# EAGLE design tachometer (EAGLE 9.6.2)
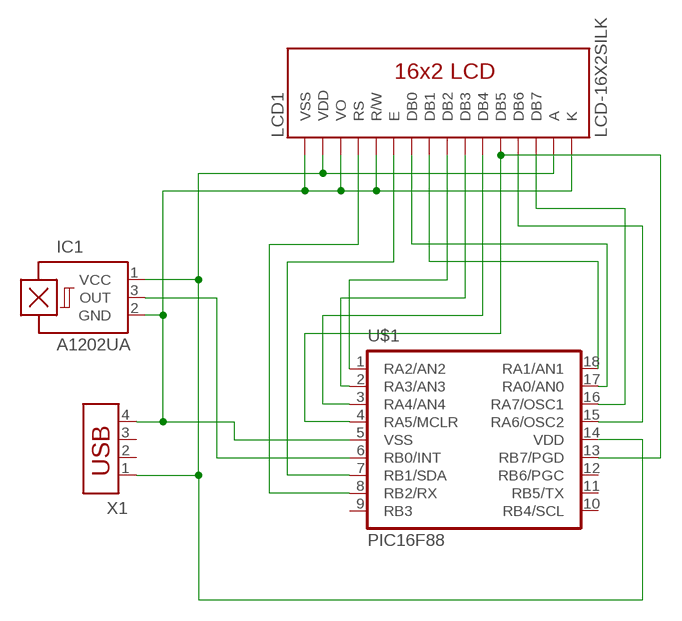
[diagram p0: schematic, sheet 1]

## Parts
IC1  A1202UA  [SIP3-UA]
LCD1  LCD-16X2SILK  [LCD-16X2]
U$1  PIC16F88  PIC16F88-DIP  [DIP18]
X1  USB-787616  [USB]

## Nets
N$1: IC1.1(VCC) LCD1.2(VDD) LCD1.15(A) U$1.14(VDD) X1.1
N$2: IC1.2(GND) LCD1.1(VSS) LCD1.3(VO) LCD1.5(R/W) LCD1.16(K) U$1.5(VSS) X1.4
N$3: IC1.3(OUT) U$1.6(RB0/INT)
N$4: LCD1.8(DB1) U$1.18(RA1/AN1)
N$5: LCD1.7(DB0) U$1.17(RA0/AN0)
N$6: LCD1.14(DB7) U$1.16(RA7/OSC1)
N$7: LCD1.13(DB6) U$1.15(RA6/OSC2)
N$8: LCD1.9(DB2) U$1.1(RA2/AN2)
N$9: LCD1.10(DB3) U$1.2(RA3/AN3)
N$10: LCD1.11(DB4) U$1.3(RA4/AN4)
N$11: LCD1.12(DB5) U$1.4(RA5/MCLR) U$1.13(RB7/PGD)
N$12: LCD1.6(E) U$1.7(RB1/SDA)
N$13: LCD1.4(RS) U$1.8(RB2/RX)
Unconnected: U$1.9(RB3) U$1.10(RB4/SCL) U$1.11(RB5/TX) U$1.12(RB6/PGC) X1.2 X1.3

## Library data of the parts
IC1 = allegro:A12*?: Hall-effect bipolar switch Source: http://www.allegromicro.com/en/Products/Part_Numbers/1202/1202.pdf; OC_FARNELL: unknown; OC_NEWARK: unknown
LCD1 = SparkFun-Displays (1):LCD-16X2: Standard text-only 16x2 parallel input LCD Basic 16 character by 2 line display. Typically utilizes the extremely common HD44780 parallel interface chipset SparkFun Products: Basic 16x2 Green <https://www.sparkfun.com/products/255> Basic 8x2 Green <https://www.sparkfun.com/products/11122>; PROD_ID: LCD-12633; SF_ID: LCD-00255
U$1 = SparkFun-IC-Microcontroller:PIC16F88-DIP: 8-bit PIC uC RETIRED; PROD_ID: IC-08463
X1 = con-amp:USB-787616: AMP connector

## Board
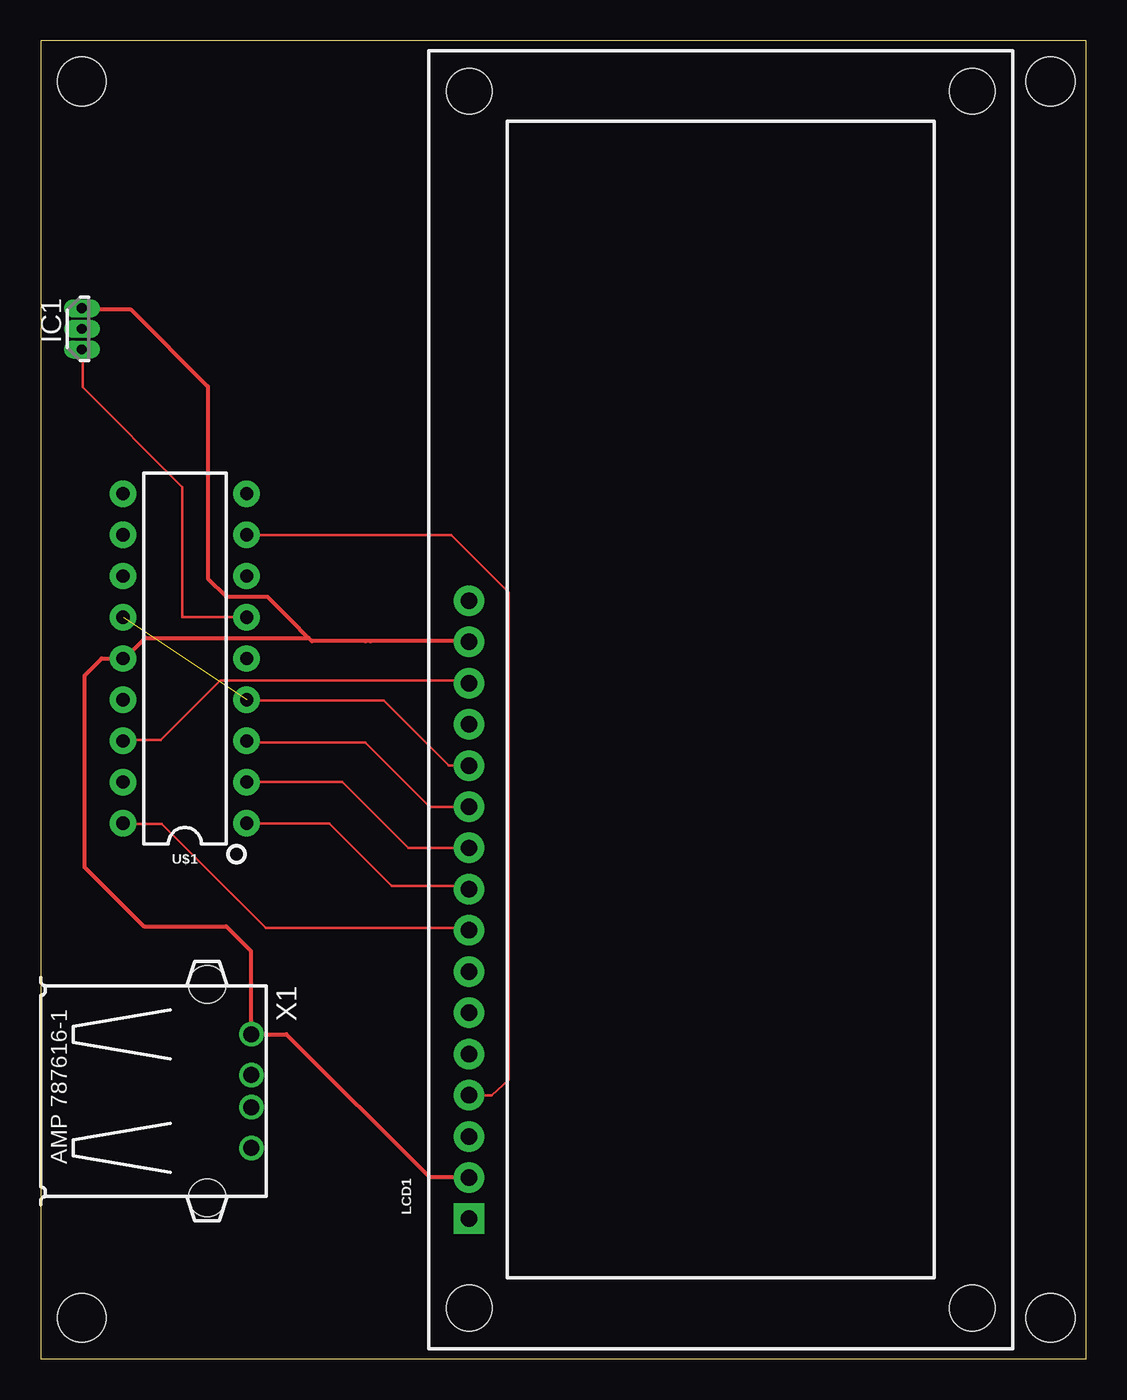
[diagram p1: board, top side]
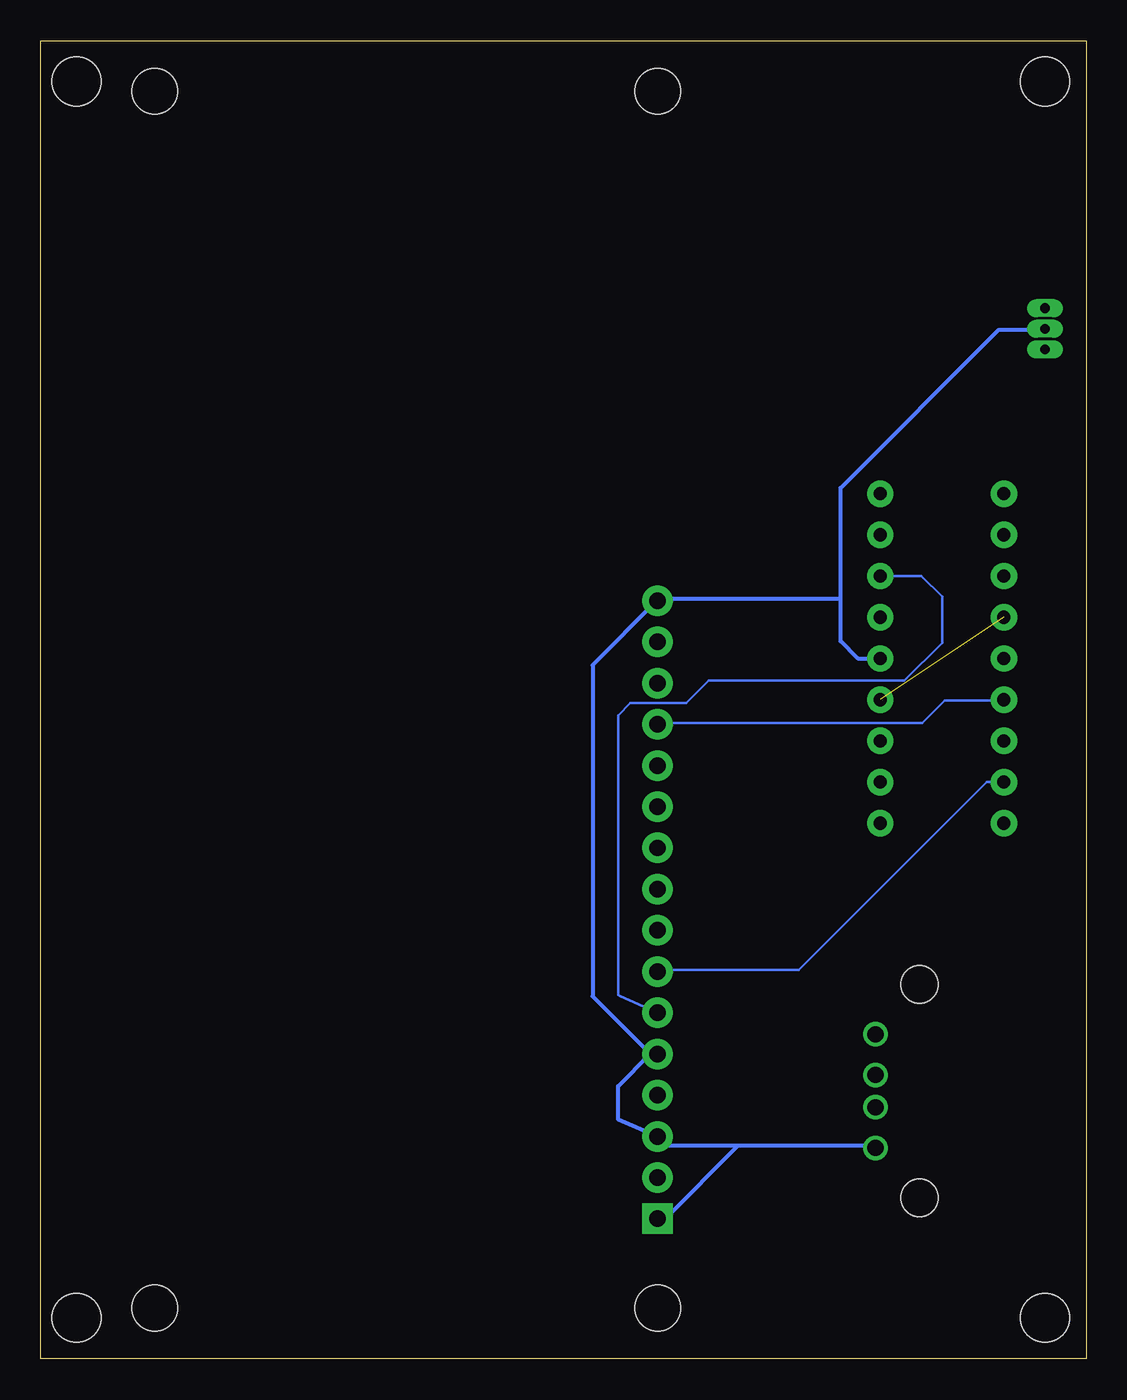
[diagram p2: board, bottom side, seen from below]

Size 64.44 x 81.27 mm. Coordinates in mm from the lower left corner, seen from the top.
Outline: 0,0 64.44,0 64.44,81.27 0,81.27 0,0
Copper layers (1*16): Top 0.035mm / dielectric 1.5mm / Bottom 0.035mm
Design rules "default": minimum track width 6mil, minimum drill 0.35mm, track to track 6mil, track to pad 6mil, pad to pad 6mil, via to via 6mil, smd to smd 6mil, copper to edge 40mil, drill to drill 6mil, minimum pad ring 10mil, minimum via ring 8mil, stop-mask expansion 4mil, vias tented up to drill 0mil, thermal gap 10mil
Holes 3 mm at 2.54,78.74 62.23,78.74 62.23,2.54 2.54,2.54

### Footprints (pad centres in the part's own frame; a part is rotated, then mirrored left to right if it is on the bottom)
SIP3-UA = drill 0.6 pad 0.7 long: 1 -1.27,0; 2 0,0; 3 1.27,0
LCD-16X2 = drill 1.016 pad 1.88 square: 1 -32,15.5 | drill 1.016 pad 1.88: 2 -29.46,15.5; 3 -26.92,15.5; 4 -24.38,15.5; 5 -21.84,15.5; 6 -19.3,15.5; 7 -16.76,15.5; 8 -14.22,15.5; 9 -11.68,15.5; 10 -9.14,15.5; 11 -6.6,15.5; 12 -4.06,15.5; 13 -1.52,15.5; 14 1.02,15.5; 15 3.56,15.5; 16 6.1,15.5 | hole 2.8: -37.5,15.5; -37.5,-15.5; 37.5,15.5; 37.5,-15.5
DIP18 = drill 0.813 pad 1.626: 1 -10.16,-3.81; 2 -7.62,-3.81; 3 -5.08,-3.81; 4 -2.54,-3.81; 5 0,-3.81; 6 2.54,-3.81; 7 5.08,-3.81; 8 7.62,-3.81; 9 10.16,-3.81; 10 10.16,3.81; 11 7.62,3.81; 12 5.08,3.81; 13 2.54,3.81; 14 0,3.81; 15 -2.54,3.81; 16 -5.08,3.81; 17 -7.62,3.81; 18 -10.16,3.81
USB = drill 1: 1 -3.5,12.99; 2 -1,12.99; 3 1,12.99; 4 3.5,12.99 | hole 2.3: -6.57,10.28; 6.57,10.28

### Placement (x,y rotation side)
IC1  2.54,63.5 270 top
LCD1  41.91,40.64 90 top
U$1  8.89,43.18 90 top
X1  0,16.51 270 top

### Tracks (layer width: path | path; a pad name or v marks a point on that pad's centre or on a via)
N$1
  Top 0.152: 2.59,64.67 IC1.1 | U$1.14 5.18,43.18 | 26.37,44.25 LCD1.15 | 12.95,20.02 X1.1
  Top 0.254: LCD1.2 23.97,11.18 15.14,20.01 X1.1 | 2.59,64.67 5.59,64.67 10.31,59.94 10.31,48.11 11.43,46.99 13.97,46.99 15.39,45.57 16.51,44.45 | 26.37,44.25 20.32,44.25 20.02,44.25 16.71,44.25 16.51,44.45 | U$1.14 3.76,43.18 2.69,42.11 2.69,30.33 6.35,26.67 11.43,26.67 12.95,25.15 12.95,20.02 | 5.18,43.18 6.45,44.45 16.51,44.45
N$2
  Bottom 0.152: 13.11,13.16 X1.4 | 26.37,13.61 LCD1.3 | 2.59,63.45 IC1.2 | 26.37,46.84 LCD1.16 26.52,46.69
  Bottom 0.254: 21.34,13.16 13.11,13.16 | 26.37,13.61 25.91,13.16 21.44,13.16 25.95,8.64 LCD1.1 | LCD1.3 28.85,14.78 28.85,16.82 26.87,18.8 LCD1.5 26.88,18.8 30.43,22.35 30.43,42.77 26.52,46.69 | 2.59,63.45 5.39,63.45 15.14,53.7 15.14,46.84 | 15.14,46.84 15.14,44.25 14.07,43.18 U$1.5 | 15.14,46.84 26.37,46.84
N$3
  Top 0.152: U$1.6 8.74,45.72 8.74,53.75 2.59,59.89 2.59,62.23 IC1.3
N$4
  Top 0.152: U$1.18 5.18,32.97 7.47,32.97 13.87,26.57 26.37,26.57 LCD1.8
N$5
  Bottom 0.152: U$1.17 6.15,35.56 17.73,23.98 26.37,23.98 LCD1.7
N$6
  Top 0.152: U$1.16 5.18,38.15 7.42,38.15 11.07,41.81 26.37,41.81 LCD1.14
N$7
  Bottom 0.152: U$1.15 5.18,40.59 8.74,40.59 10.11,39.22 26.37,39.22 LCD1.13
N$8
  Top 0.152: LCD1.9 26.37,29.01 26.21,29.16 21.64,29.16 17.78,33.02 U$1.1
N$9
  Top 0.152: U$1.2 18.59,35.56 22.65,31.5 LCD1.10
N$10
  Top 0.152: LCD1.11 23.97,34.04 20.02,38 12.8,38 U$1.3
N$11  (1 unrouted)
  Top 0.152: LCD1.12 25.14,36.58 21.13,40.59 12.8,40.59 U$1.4
N$12
  Bottom 0.152: LCD1.6 28.77,22.36 28.85,22.45 28.85,39.68 28.09,40.44 24.64,40.44 23.27,41.81 11.23,41.81 8.89,44.15 8.89,46.99 10.16,48.26 U$1.7
N$13
  Top 0.152: U$1.8 25.3,50.8 28.85,47.24 28.85,17.21 27.81,16.26 LCD1.4